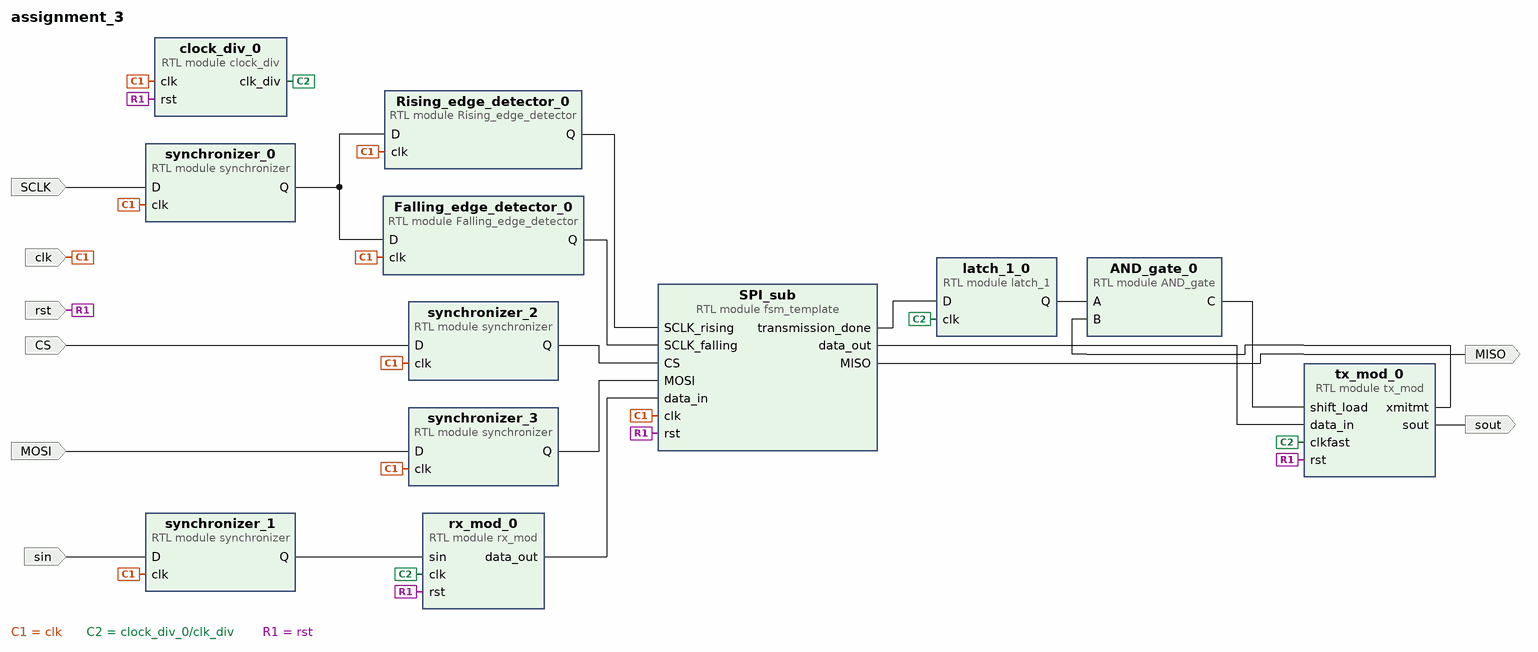
[diagram p0: block diagram of the top level]
# Vivado block design assignment_3, xc7z020clg400-1, Vivado 2023.2
create_bd_design assignment_3

create_bd_port -dir I MOSI
create_bd_port -dir I -type clk clk
create_bd_port -dir I SCLK
create_bd_port -dir I CS
create_bd_port -dir I sin
create_bd_port -dir I rst
create_bd_port -dir O MISO
create_bd_port -dir O sout

create_bd_cell -type module -reference fsm_template SPI_sub
set_property -dict {CONFIG.n_bits 8} [get_bd_cells SPI_sub]
create_bd_cell -type module -reference synchronizer synchronizer_0
create_bd_cell -type module -reference synchronizer synchronizer_1
create_bd_cell -type module -reference synchronizer synchronizer_2
create_bd_cell -type module -reference synchronizer synchronizer_3
create_bd_cell -type module -reference Rising_edge_detector Rising_edge_detector_0
create_bd_cell -type module -reference Falling_edge_detector Falling_edge_detector_0
create_bd_cell -type module -reference rx_mod rx_mod_0
create_bd_cell -type module -reference latch_1 latch_1_0
create_bd_cell -type module -reference AND_gate AND_gate_0
create_bd_cell -type module -reference tx_mod tx_mod_0
create_bd_cell -type module -reference clock_div clock_div_0

# ---- connections ----

connect_bd_net [get_bd_pins AND_gate_0/C] [get_bd_pins tx_mod_0/shift_load]
connect_bd_net -net D_0_2 [get_bd_ports SCLK] [get_bd_pins synchronizer_0/D]
connect_bd_net -net D_0_3 [get_bd_ports CS] [get_bd_pins synchronizer_2/D]
connect_bd_net -net D_0_4 [get_bd_ports sin] [get_bd_pins synchronizer_1/D]
connect_bd_net [get_bd_pins Falling_edge_detector_0/Q] [get_bd_pins SPI_sub/SCLK_falling]
connect_bd_net [get_bd_ports MOSI] [get_bd_pins synchronizer_3/D]
connect_bd_net [get_bd_pins Rising_edge_detector_0/Q] [get_bd_pins SPI_sub/SCLK_rising]
connect_bd_net [get_bd_pins SPI_sub/MISO] [get_bd_ports MISO]
connect_bd_net [get_bd_pins SPI_sub/data_out] [get_bd_pins tx_mod_0/data_in]
connect_bd_net [get_bd_pins SPI_sub/transmission_done] [get_bd_pins latch_1_0/D]
connect_bd_net -net clk_0_1 [get_bd_ports clk] \
  [get_bd_pins synchronizer_3/clk] [get_bd_pins synchronizer_0/clk] [get_bd_pins synchronizer_2/clk] \
  [get_bd_pins synchronizer_1/clk] [get_bd_pins Rising_edge_detector_0/clk] [get_bd_pins Falling_edge_detector_0/clk] \
  [get_bd_pins SPI_sub/clk] [get_bd_pins clock_div_0/clk]
connect_bd_net [get_bd_pins clock_div_0/clk_div] [get_bd_pins rx_mod_0/clk] [get_bd_pins tx_mod_0/clkfast] [get_bd_pins latch_1_0/clk]
connect_bd_net [get_bd_pins latch_1_0/Q] [get_bd_pins AND_gate_0/A]
connect_bd_net [get_bd_ports rst] [get_bd_pins SPI_sub/rst] [get_bd_pins tx_mod_0/rst] [get_bd_pins rx_mod_0/rst] [get_bd_pins clock_div_0/rst]
connect_bd_net [get_bd_pins rx_mod_0/data_out] [get_bd_pins SPI_sub/data_in]
connect_bd_net [get_bd_pins synchronizer_0/Q] [get_bd_pins Rising_edge_detector_0/D] [get_bd_pins Falling_edge_detector_0/D]
connect_bd_net [get_bd_pins synchronizer_1/Q] [get_bd_pins rx_mod_0/sin]
connect_bd_net [get_bd_pins synchronizer_2/Q] [get_bd_pins SPI_sub/CS]
connect_bd_net [get_bd_pins synchronizer_3/Q] [get_bd_pins SPI_sub/MOSI]
connect_bd_net [get_bd_pins tx_mod_0/sout] [get_bd_ports sout]
connect_bd_net [get_bd_pins tx_mod_0/xmitmt] [get_bd_pins AND_gate_0/B]

validate_bd_design
save_bd_design
